# Altium schematic sheet GPSDO_Heater.SchDoc: Heater
size 420 x 297 mm; EDA_Number: ARTIQ; Projet: GPSDO; Author: K.Belewicz; CompanyName: WUT ISE; DrawnBy: K.Belewicz; Organization: WUT ISE; Address1: PW ISE; Address2: Nowowiejska 15/19 00-665 Warsaw; Address3: gkasprow@gmail.com; Revision: 1; SheetNumber: -; SheetTotal: -; ModifiedBy: -; CheckedDate: -; DivGrp: WUT ISE; Designer: G.Kasprowicz; ModifiedDate: -; ProjectName: Sensor Box
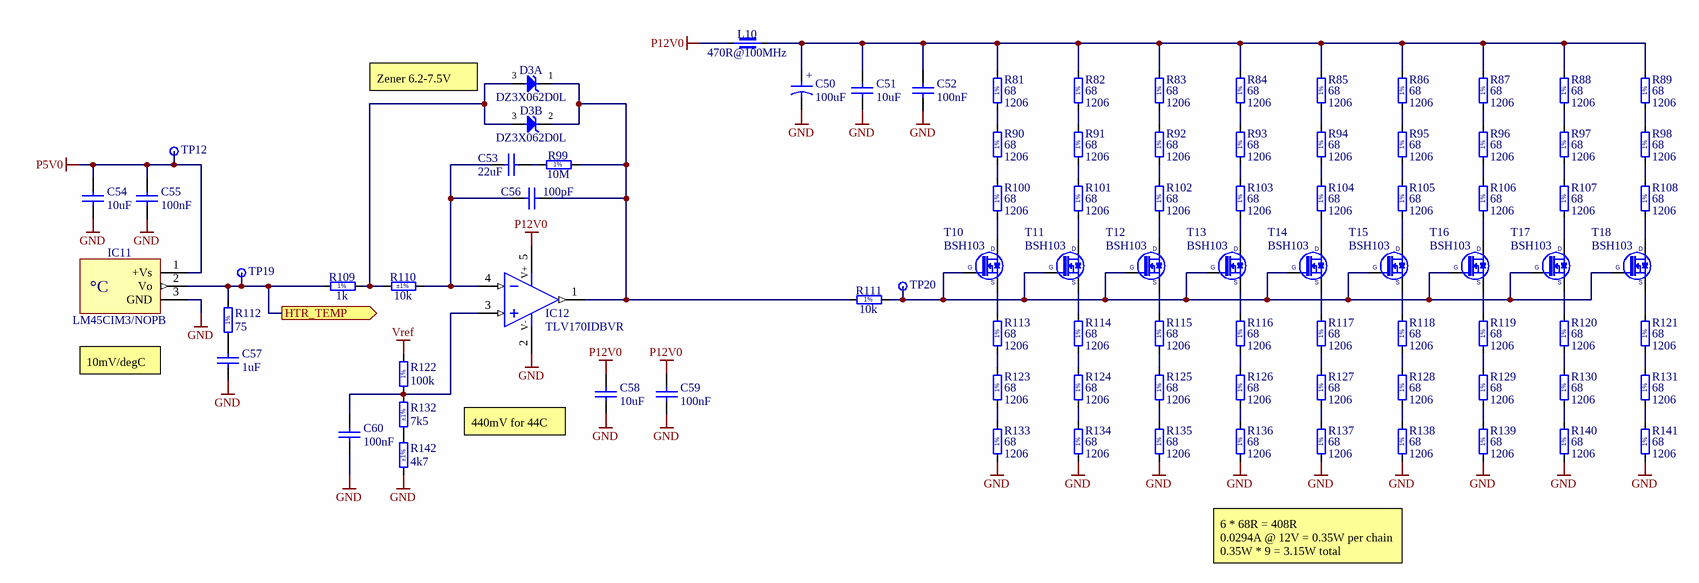
[diagram p0: GPSDO_Heater.SchDoc]

## Parts
C50  100uF  [CAPMP7343X310N]
C51  10uF  [CAPC1608X80N]
C52  100nF  [CAPC1005X55N]
C53  22uF  [CAPC2012X135N]
C54  10uF  [CAPC1608X80N]
C55  100nF  [CAPC1005X55N]
C56  100pF  [CAPC1005X55N]
C57  1uF  [CAPC1005X55N]
C58  10uF  [CAPC1608X80N]
C59  100nF  [CAPC1005X55N]
C60  100nF  [CAPC1005X55N]
D3  DZ3X062D0L  [SOT95P275X140-3N]  (parts A,B of 2)
IC11  LM45CIM3/NOPB  [SOT95P251X112-3N]
IC12  TLV170IDBVR  [SOT95P280X145-5N]
L10  470R@100MHz  [INDC1608X95N]
R81  68  Case: 1206  [RESC3216X65N]
R82  68  Case: 1206  [RESC3216X65N]
R83  68  Case: 1206  [RESC3216X65N]
R84  68  Case: 1206  [RESC3216X65N]
R85  68  Case: 1206  [RESC3216X65N]
R86  68  Case: 1206  [RESC3216X65N]
R87  68  Case: 1206  [RESC3216X65N]
R88  68  Case: 1206  [RESC3216X65N]
R89  68  Case: 1206  [RESC3216X65N]
R90  68  Case: 1206  [RESC3216X65N]
R91  68  Case: 1206  [RESC3216X65N]
R92  68  Case: 1206  [RESC3216X65N]
R93  68  Case: 1206  [RESC3216X65N]
R94  68  Case: 1206  [RESC3216X65N]
R95  68  Case: 1206  [RESC3216X65N]
R96  68  Case: 1206  [RESC3216X65N]
R97  68  Case: 1206  [RESC3216X65N]
R98  68  Case: 1206  [RESC3216X65N]
R99  10M  [RESC2113X55N]
R100  68  Case: 1206  [RESC3216X65N]
R101  68  Case: 1206  [RESC3216X65N]
R102  68  Case: 1206  [RESC3216X65N]
R103  68  Case: 1206  [RESC3216X65N]
R104  68  Case: 1206  [RESC3216X65N]
R105  68  Case: 1206  [RESC3216X65N]
R106  68  Case: 1206  [RESC3216X65N]
R107  68  Case: 1206  [RESC3216X65N]
R108  68  Case: 1206  [RESC3216X65N]
R109  1k  [RESC1005X40N]
R110  10k  Tolerance: ±1%  [RESC1005X40N]
R111  10k  [RESC1005X40N]
R112  75  [RESC1005X40N]
R113  68  Case: 1206  [RESC3216X65N]
R114  68  Case: 1206  [RESC3216X65N]
R115  68  Case: 1206  [RESC3216X65N]
R116  68  Case: 1206  [RESC3216X65N]
R117  68  Case: 1206  [RESC3216X65N]
R118  68  Case: 1206  [RESC3216X65N]
R119  68  Case: 1206  [RESC3216X65N]
R120  68  Case: 1206  [RESC3216X65N]
R121  68  Case: 1206  [RESC3216X65N]
R122  100k  [RESC1005X40N]
R123  68  Case: 1206  [RESC3216X65N]
R124  68  Case: 1206  [RESC3216X65N]
R125  68  Case: 1206  [RESC3216X65N]
R126  68  Case: 1206  [RESC3216X65N]
R127  68  Case: 1206  [RESC3216X65N]
R128  68  Case: 1206  [RESC3216X65N]
R129  68  Case: 1206  [RESC3216X65N]
R130  68  Case: 1206  [RESC3216X65N]
R131  68  Case: 1206  [RESC3216X65N]
R132  7k5  Tolerance: ±1%  [RESC1005X40N]
R133  68  Case: 1206  [RESC3216X65N]
R134  68  Case: 1206  [RESC3216X65N]
R135  68  Case: 1206  [RESC3216X65N]
R136  68  Case: 1206  [RESC3216X65N]
R137  68  Case: 1206  [RESC3216X65N]
R138  68  Case: 1206  [RESC3216X65N]
R139  68  Case: 1206  [RESC3216X65N]
R140  68  Case: 1206  [RESC3216X65N]
R141  68  Case: 1206  [RESC3216X65N]
R142  4k7  Tolerance: ±1%  [RESC1005X40N]
T10  BSH103  [SOT95P230X110-3N]
T11  BSH103  [SOT95P230X110-3N]
T12  BSH103  [SOT95P230X110-3N]
T13  BSH103  [SOT95P230X110-3N]
T14  BSH103  [SOT95P230X110-3N]
T15  BSH103  [SOT95P230X110-3N]
T16  BSH103  [SOT95P230X110-3N]
T17  BSH103  [SOT95P230X110-3N]
T18  BSH103  [SOT95P230X110-3N]
TP12  Test Point  [TPS127]  (value not drawn)  (no BOM)
TP19  Test Point  [TPS127]  (value not drawn)  (no BOM)
TP20  Test Point  [TPS127]  (value not drawn)  (no BOM)

## Ports
HTR_TEMP (out)

## Nets
GND: C50.2 C51.1 C52.1 C54.1 C55.1 C57.1 C58.1 C59.1 C60.1 IC11.3(GND) IC12.2(V-) R133.1 R134.1 R135.1 R136.1 R137.1 R138.1 R139.1 R140.1 R141.1 R142.1
P5V0: C54.2 C55.2 IC11.1(+Vs) TP12.1
P12V0: C58.2 C59.2 IC12.5(V+) L10.1
Vref: R122.2
HTR_TEMP: IC11.2(Vo) R109.1 R112.2 TP19.1 ; port HTR_TEMP
NetC50_1: C50.1 C51.2 C52.2 L10.2 R81.2 R82.2 R83.2 R84.2 R85.2 R86.2 R87.2 R88.2 R89.2
NetC53_1: C53.1 C56.1 IC12.4(IN-) R110.2
NetC53_2: C53.2 R99.1
NetC56_2: C56.2 D3.1(C) D3.2(C) IC12.1(OUT) R99.2 R111.1
NetC57_2: C57.2 R112.1
NetC60_2: C60.2 IC12.3(IN+) R122.1 R132.2
NetD3_3: D3.3(COMA) R109.2 R110.1
NetR81_1: R81.1 R90.2
NetR82_1: R82.1 R91.2
NetR83_1: R83.1 R92.2
NetR84_1: R84.1 R93.2
NetR85_1: R85.1 R94.2
NetR86_1: R86.1 R95.2
NetR87_1: R87.1 R96.2
NetR88_1: R88.1 R97.2
NetR89_1: R89.1 R98.2
NetR90_1: R90.1 R100.2
NetR91_1: R91.1 R101.2
NetR92_1: R92.1 R102.2
NetR93_1: R93.1 R103.2
NetR94_1: R94.1 R104.2
NetR95_1: R95.1 R105.2
NetR96_1: R96.1 R106.2
NetR97_1: R97.1 R107.2
NetR98_1: R98.1 R108.2
NetR100_1: R100.1 T10.3(D)
NetR101_1: R101.1 T11.3(D)
NetR102_1: R102.1 T12.3(D)
NetR103_1: R103.1 T13.3(D)
NetR104_1: R104.1 T14.3(D)
NetR105_1: R105.1 T15.3(D)
NetR106_1: R106.1 T16.3(D)
NetR107_1: R107.1 T17.3(D)
NetR108_1: R108.1 T18.3(D)
NetR111_2: R111.2 T10.1(G) T11.1(G) T12.1(G) T13.1(G) T14.1(G) T15.1(G) T16.1(G) T17.1(G) T18.1(G) TP20.1
NetR113_1: R113.1 R123.2
NetR113_2: R113.2 T10.2(S)
NetR114_1: R114.1 R124.2
NetR114_2: R114.2 T11.2(S)
NetR115_1: R115.1 R125.2
NetR115_2: R115.2 T12.2(S)
NetR116_1: R116.1 R126.2
NetR116_2: R116.2 T13.2(S)
NetR117_1: R117.1 R127.2
NetR117_2: R117.2 T14.2(S)
NetR118_1: R118.1 R128.2
NetR118_2: R118.2 T15.2(S)
NetR119_1: R119.1 R129.2
NetR119_2: R119.2 T16.2(S)
NetR120_1: R120.1 R130.2
NetR120_2: R120.2 T17.2(S)
NetR121_1: R121.1 R131.2
NetR121_2: R121.2 T18.2(S)
NetR123_1: R123.1 R133.2
NetR124_1: R124.1 R134.2
NetR125_1: R125.1 R135.2
NetR126_1: R126.1 R136.2
NetR127_1: R127.1 R137.2
NetR128_1: R128.1 R138.2
NetR129_1: R129.1 R139.2
NetR130_1: R130.1 R140.2
NetR131_1: R131.1 R141.2
NetR132_1: R132.1 R142.2

## Notes on the sheet
- (near D3) Zener 6.2-7.5V
- 10mV/degC
- 440mV for 44C
- 6 * 68R = 408R
  0.0294A @ 12V = 0.35W per chain
  0.35W * 9 = 3.15W total
- Project/Equipment
- Document
- Designer
- Drawn by
- Check.by
- Copyright WUT ISE 2020.
  This documentation describes Open Hardware and is licensed under the CERN OHL v.1.2. You may redistribute and modify this documentation under the terms of the CERN OHL v.1.2. (http://ohwr.org/CERNOHL). This documentation is distributed WITHOUT ANY EXPRESS OR IMPLIED WARRANTY, INCLUDING OF MERCHANTABILITY, SATISFACTORY QUALITY AND FITNESS FOR A PARTICULAR PURPOSE. Please see the CERN OHL v.1.2 for applicable conditions.
- Contact
- File
- Last Mod.
- Print Date
- Sheet
- Size
- A3
- of
- Rev
- (in symbol CTE7343-31_100UF_20V_10%) +
- (in symbol LM45CIM3/NOPB) °C
- (in symbol R0402_1k_1%_0.0625W_100PPM) 1%
- (in symbol R0402_10K_1%_0.0625W_100PPM) 1%
- (in symbol R0402_75R_1%_0.0625W_100PPM) 1%
- (in symbol R0402_100K_1%_0.0625W_100PPM) 1%
- (in symbol R0805_10M_1%_0.125W_100PPM_VISHAY_CRCW e3) 1%
- (in symbol R1206_68R_1%_0.25W_100PPM) 1%

## Library data of the parts
C50 = CTE7343-31_100UF_20V_10%: Polarised capacitor; Part Description: Solid Tantalum Chip Capacitor; Manufacturer: GENERIC; Manufacturer1 Part Number: TAJD107K020R; Voltage: 20V; Tolerance: ±10%; Part Number: CTE7343-31_100UF_20V_10%; Component Kind: Standard; Component Type: Standard; Pin Count: 2; Value: 100uF; Status: Preferred; Manufacturer Part Number: CTE7343-31_100UF_20V_10%; Case: D; Mounted: Yes; Socket: No; SMD: Yes; Sense: No; Manufacturer1 Example: AVX; Manufacturer1 ComponentHeight: 3.1mm; HelpURL: \\cern.ch\dfs\Applications\Altium\Datasheets\CTE_AVX_TAJ.pdf; Author: CERN DEM JLC; CreateDate: 03/12/2007; LatestRevisionDate: 03/12/2007
C51 C54 C58 = CC0603_10UF_10V_10%_X5R: Non-polarised capacitor; Part Description: SMD Multilayer Chip Ceramic Capacitor; Manufacturer: GENERIC; Manufacturer1 Part Number: GRM188R61A106KE69D; Voltage: 10V; TC: X5R; Tolerance: ±10%; Part Number: CC0603_10UF_10V_10%_X5R; Component Kind: Standard; Component Type: Standard; Pin Count: 2; Value: 10uF; Status: None; Manufacturer Part Number: CC0603_10UF_10V_10%_X5R; Case: 0603; Mounted: Yes; Socket: No; SMD: Yes; Sense: No; Manufacturer1 Example: MURATA; Manufacturer1 ComponentHeight: 0.8mm; HelpURL: \\cern.ch\dfs\Applications\Altium\Datasheets\CC0603_MURATA_GRM188R61A106KE69D.pdf; Author: CERN DEM JLC; CreateDate: 31.01.2017; LatestRevisionDate: 31.01.2017
C52 C55 C59 C60 = CC0402_100NF_16V_10%_X5R: Non-polarised capacitor; Part Description: SMD Multilayer Chip Ceramic Capacitor; Manufacturer: GENERIC; Manufacturer1 Part Number: GRM155R61C104KA88D; Voltage: 16V; TC: X5R; Tolerance: ±10%; Part Number: CC0402_100NF_16V_10%_X5R; Component Kind: Standard; Component Type: Standard; Pin Count: 2; Value: 100nF; Status: None; Manufacturer Part Number: CC0402_100NF_16V_10%_X5R; Case: 0402; Mounted: Yes; Socket: No; SMD: Yes; Sense: No; Manufacturer1 Example: MURATA; Manufacturer1 ComponentHeight: 0.55mm; HelpURL: \\cern.ch\dfs\Applications\Altium\Datasheets\CC0402_X5R_MURATA_GRM.pdf; Author: CERN DEM JLC; CreateDate: 10.12.2013; LatestRevisionDate: 10.12.2013
C53 = CC0805_22UF_16V_10%_X5R: Non-polarised capacitor; Manufacturer: GENERIC; Part Description: SMD Multilayer Chip Ceramic Capacitor; Manufacturer1 Part Number: C2012X5R1C226KT; Tolerance: ±10%; Voltage: 16V; TC: X5R; Manufacturer Part Number: CC0805_22UF_16V_10%_X5R; Part Number: CC0805_22UF_16V_10%_X5R; Value: 22uF; Component Kind: Standard; Component Type: Standard; Pin Count: 2; Status: Preferred; Case: 0805; Mounted: Yes; Socket: No; SMD: Yes; Sense: No; Manufacturer1 Example: TDK; Manufacturer1 ComponentHeight: 1.35mm; HelpURL: \\cern.ch\dfs\Applications\Altium\Datasheets\CC0805_X5R_TDK_C.pdf; Author: CERN DEM JLC; CreateDate: 25.10.2012; LatestRevisionDate: 25.10.2012
C56 = CC0402_100PF_50V_5%_C0G: Non-polarised capacitor; Part Description: SMD Multilayer Chip Ceramic Capacitor; Manufacturer: GENERIC; Manufacturer1 Part Number: C0402C101J5GACTU; Voltage: 50V; TC: C0G/NP0; Tolerance: ±5%; Part Number: CC0402_100PF_50V_5%_C0G; Component Kind: Standard; Component Type: Standard; Pin Count: 2; Value: 100pF; Status: Preferred; Manufacturer Part Number: CC0402_100PF_50V_5%_C0G; Case: 0402; Mounted: Yes; Socket: No; SMD: Yes; Sense: No; Manufacturer1 Example: KEMET; Manufacturer1 ComponentHeight: 0.55mm; HelpURL: \\cern.ch\dfs\Applications\Altium\Datasheets\CC0402_C0G_KEMET_(Commercial Grade).pdf; Author: CERN DEM JLC; CreateDate: 03/12/2007; LatestRevisionDate: 22/04/2015
C57 = CC0402_1UF_16V_10%_X5R: Non-polarised capacitor; Part Description: SMD Multilayer Chip Ceramic Capacitor; Manufacturer: GENERIC; Manufacturer1 Part Number: C1005X5R1C105KT; Voltage: 16V; TC: X5R; Tolerance: ±10%; Part Number: CC0402_1UF_16V_10%_X5R; Component Kind: Standard; Component Type: Standard; Pin Count: 2; Value: 1uF; Status: Preferred; Manufacturer Part Number: CC0402_1UF_16V_10%_X5R; Case: 0402; Mounted: Yes; Socket: No; SMD: Yes; Sense: No; Manufacturer1 Example: TDK; Manufacturer1 ComponentHeight: 0.55mm; HelpURL: \\cern.ch\dfs\Applications\Altium\Datasheets\CC0402_X5R_TDK_C.pdf; Author: CERN DEM JLC; CreateDate: 25.10.2012; LatestRevisionDate: 25.10.2012
D3 = DZ3X062D0L: Dual Common Anode Zener Diode; Part Description: Dual Common Anode Silicon Epitaxial Planar Diode; Manufacturer: PANASONIC; Voltage: 6.2V; Power: 200mA; PressFit: No; Bonding: No; Part Number: DZ3X062D0L; Component Kind: Standard; Component Type: Standard; Device: DZ3X062D0L; PackageDescription: SOT, 0.95mm Pitch; 3 Pin, 1.60mm W X 2.975mm L X 1.40mm H Body, IPC Medium Density; Manufacturer Part Number: DZ3X062D0L; Pin Count: 3; Case: SOT23-3; Mounted: Yes; Socket: No; SMD: Yes; Sense: No; ComponentHeight: 1.40mm; HelpURL: \\cern.ch\dfs\Applications\Altium\Datasheets\DZ3X062D0L.pdf; Author: CERN DEM JLC; CreateDate: 30/09/2014; LatestRevisionDate: 30/09/2014
IC11 = LM45CIM3/NOPB: -20° to +100°C ±3°C Precision Centigrade Temperature Sensors; Manufacturer: TEXAS INSTRUMENTS; PressFit: No; Bonding: No; Part Number: LM45CIM3/NOPB; Component Kind: Standard; Component Type: Standard; Device: LM45CIM3/NOPB; PackageDescription: SOT, 0.95mm Pitch; 3 Pin, 1.30mm W X 2.92mm L X 1.12mm H body, IPC Medium Density; Part Description: -20° to +100°C ±3°C Precision Centigrade Temperature Sensors; Manufacturer Part Number: LM45CIM3/NOPB; Pin Count: 3; Case: SOT23; Mounted: Yes; Socket: No; SMD: Yes; Sense: No; ComponentHeight: 1.12mm; HelpURL: \\cern.ch\dfs\Applications\Altium\Datasheets\LM45CIM3-NOPB.pdf; Author: CERN DEM JLC; CreateDate: 19/01/2011; LatestRevisionDate: 19/01/2011
IC12 = TLV170IDBVR: Low-Power, 36-V Operational Amplifier; Manufacturer: TEXAS INSTRUMENTS; Part Number: TLV170IDBVR; Device: TLV170IDBVR; Component Kind: Standard; Component Type: Standard; PackageDescription: SOT, 0.95mm pitch; 5 pin, 1.60mm W X 2.90mm L X 1.45mm H body, IPC Medium Density; Part Description: Low-Power, 36-V Operational Amplifier; Case: SOT 23-5; Manufacturer Part Number: TLV170IDBVR
L10 = IND0603_MURATA_BLM18PG471SN1D: Part Description: SMD EMIFIL Chip Ferrite Bead; Manufacturer: MURATA; Power: 1A; Resistance: 0.2R; Tolerance: ±25%; Part Number: IND0603_MURATA_BLM18PG471SN1D; Component Kind: Standard; Component Type: Standard; Pin Count: 2; Value: 470R@100MHz; Manufacturer Part Number: BLM18PG471SN1D; Case: 0603; Mounted: Yes; Socket: No; SMD: Yes; Sense: No; ComponentHeight: 0.95mm; HelpURL: \\cern.ch\dfs\Applications\Altium\Datasheets\IND0603_MURATA_BLM18P.pdf; Author: CERN DEM BC; CreateDate: 17.02.2021; LatestRevisionDate: 17.02.2021
R81-R98 R100-R108 R113-R121 R123-R131 R133-R141 = R1206_68R_1%_0.25W_100PPM: Resistor - 1%; Part Description: General Purpose Thick Film Chip Resistor; Manufacturer: GENERIC; Manufacturer1 Part Number: NRC12F68R0TRF; Power: 0.25W; TC: ±100ppm/°C; PressFit: No; Part Number: R1206_68R_1%_0.25W_100PPM; Component Kind: Standard; Component Type: Standard; Pin Count: 2; Value: 68; Status: Preferred; Tolerance: ±1%; Manufacturer Part Number: R1206_68R_1%_0.25W_100PPM; Mounted: Yes; Sense: No; Socket: No; SMD: Yes; Manufacturer1 Example: NIC COMPONENT; Manufacturer1 ComponentHeight: 0.65mm; HelpURL: \\cern.ch\dfs\Applications\Altium\Datasheets\R1206_NIC_NRC.pdf; Author: CERN DEM JLC; CreateDate: 03/12/2007; LatestRevisionDate: 13/03/2008
R99 = R0805_10M_1%_0.125W_100PPM_VISHAY_CRCW e3: Resistor - 1%; Part Description: 150V, Standard Thick Film Chip Resistor; Manufacturer: VISHAY DALE; Manufacturer Part Number: CRCW080510M0FKEA; Power: 0.125W; TC: ±100ppm/°C; PressFit: No; Part Number: R0805_10M_1%_0.125W_100PPM_VISHAY_CRCW e3; Component Kind: Standard; Component Type: Standard; Pin Count: 2; Value: 10M; Status: None; Tolerance: ±1%; Case: 0805; Mounted: Yes; Sense: No; Socket: No; SMD: Yes; ComponentHeight: 0.5mm; HelpURL: \\cern.ch\dfs\Applications\Altium\Datasheets\R0805_VISHAY_CRCW e3.pdf; Author: CERN DEM BC; CreateDate: 2019-11-12; LatestRevisionDate: 2019-11-12
R109 = R0402_1k_1%_0.0625W_100PPM: Resistor - 1%; Part Description: General Purpose Thick Film Chip Resistor; Manufacturer: GENERIC; Manufacturer1 Part Number: 232270671002L; TC: ±100ppm/°C; PressFit: No; Part Number: R0402_1K_1%_0.0625W_100PPM; Component Kind: Standard; Component Type: Standard; Pin Count: 2; Value: 1k; Status: Not Recommended; Power: 0.0625W; Tolerance: ±1%; Manufacturer Part Number: R0402_1K_1%_0.0625W_100PPM; Case: 0402; Mounted: Yes; Sense: No; Socket: No; SMD: Yes; Manufacturer1 Example: YAGEO PHYCOMP; Manufacturer1 ComponentHeight: 0.4mm; HelpURL: \\cern.ch\dfs\Applications\Altium\Datasheets\R0402_Phycomp_RC0402.pdf; Author: CERN DEM JLC; CreateDate: 03.12.2007; LatestRevisionDate: 17.10.2012; ClassName: Artix
R110 R111 = R0402_10K_1%_0.0625W_100PPM: Resistor - 1%; Part Description: General Purpose Thick Film Chip Resistor; Manufacturer: GENERIC; Manufacturer1 Part Number: 232270671003L; TC: ±100ppm/°C; PressFit: No; Part Number: R0402_10K_1%_0.0625W_100PPM; Component Kind: Standard; Component Type: Standard; Pin Count: 2; Value: 10k; Status: Not Recommended; Power: 0.0625W; Manufacturer Part Number: R0402_10K_1%_0.0625W_100PPM; Case: 0402; Mounted: Yes; Sense: No; Socket: No; SMD: Yes; Manufacturer1 Example: YAGEO PHYCOMP; Manufacturer1 ComponentHeight: 0.4mm; HelpURL: \\cern.ch\dfs\Applications\Altium\Datasheets\R0402_Phycomp_RC0402.pdf; Author: CERN DEM JLC; CreateDate: 03.12.2007; LatestRevisionDate: 17.10.2012
  R111: Tolerance: ±1%
R112 = R0402_75R_1%_0.0625W_100PPM: Resistor - 1%; Part Description: General Purpose Thick Film Chip Resistor; Manufacturer: GENERIC; Manufacturer1 Part Number: 232270677509L; TC: ±100ppm/°C; PressFit: No; Part Number: R0402_75R_1%_0.0625W_100PPM; Component Kind: Standard; Component Type: Standard; Pin Count: 2; Value: 75; Status: Not Recommended; Power: 0.0625W; Tolerance: ±1%; Manufacturer Part Number: R0402_75R_1%_0.0625W_100PPM; Case: 0402; Mounted: Yes; Sense: No; Socket: No; SMD: Yes; Manufacturer1 Example: YAGEO PHYCOMP; Manufacturer1 ComponentHeight: 0.4mm; HelpURL: \\cern.ch\dfs\Applications\Altium\Datasheets\R0402_Phycomp_RC0402.pdf; Author: CERN DEM JLC; CreateDate: 03/12/2007; LatestRevisionDate: 17/10/2012
R122 = R0402_100K_1%_0.0625W_100PPM: Resistor - 1%; Part Description: General Purpose Thick Film Chip Resistor; Manufacturer: GENERIC; Manufacturer1 Part Number: 232270671004L; TC: ±100ppm/°C; PressFit: No; Part Number: R0402_100K_1%_0.0625W_100PPM; Component Kind: Standard; Component Type: Standard; Pin Count: 2; Value: 100k; Status: Not Recommended; Power: 0.0625W; Tolerance: ±1%; Manufacturer Part Number: R0402_100K_1%_0.0625W_100PPM; Case: 0402; Mounted: Yes; Sense: No; Socket: No; SMD: Yes; Manufacturer1 Example: YAGEO PHYCOMP; Manufacturer1 ComponentHeight: 0.4mm; HelpURL: \\cern.ch\dfs\Applications\Altium\Datasheets\R0402_Phycomp_RC0402.pdf; Author: CERN DEM JLC; CreateDate: 03/12/2007; LatestRevisionDate: 17/10/2012
R132 = R0402_7K5_1%_0.0625W_100PPM: Resistor - 1%; Part Description: General Purpose Thick Film Chip Resistor; Manufacturer: GENERIC; Manufacturer1 Part Number: 232270677502L; TC: ±100ppm/°C; PressFit: No; Part Number: R0402_7K5_1%_0.0625W_100PPM; Component Kind: Standard; Component Type: Standard; Pin Count: 2; Value: 7k5; Status: Not Recommended; Power: 0.0625W; Manufacturer Part Number: R0402_7K5_1%_0.0625W_100PPM; Case: 0402; Mounted: Yes; Sense: No; Socket: No; SMD: Yes; Manufacturer1 Example: YAGEO PHYCOMP; Manufacturer1 ComponentHeight: 0.4mm; HelpURL: \\cern.ch\dfs\Applications\Altium\Datasheets\R0402_Phycomp_RC0402.pdf; Author: CERN DEM JLC; CreateDate: 03.12.2007; LatestRevisionDate: 17.10.2012
R142 = R0402_4K7_1%_0.0625W_100PPM: Resistor - 1%; Part Description: General Purpose Thick Film Chip Resistor; Manufacturer: GENERIC; Manufacturer1 Part Number: 232270674702L; TC: ±100ppm/°C; PressFit: No; Part Number: R0402_4K7_1%_0.0625W_100PPM; Component Kind: Standard; Component Type: Standard; Pin Count: 2; Value: 4k7; Status: Not Recommended; Power: 0.0625W; Manufacturer Part Number: R0402_4K7_1%_0.0625W_100PPM; Case: 0402; Mounted: Yes; Sense: No; Socket: No; SMD: Yes; Manufacturer1 Example: YAGEO PHYCOMP; Manufacturer1 ComponentHeight: 0.4mm; HelpURL: \\cern.ch\dfs\Applications\Altium\Datasheets\R0402_Phycomp_RC0402.pdf; Author: CERN DEM JLC; CreateDate: 03.12.2007; LatestRevisionDate: 17.10.2012
T10-T18 = BSH103: N-CHANNEL MOSFET WITH DIODE; Part Description: 30V 850mA N-Channel Enhancement Mode Field-Effect Transistor; Manufacturer: NEXPERIA; PressFit: No; Bonding: No; Part Number: BSH103; Component Kind: Standard; Component Type: Standard; Device: BSH103; PackageDescription: SOT23, 3 pin, Pitch 0.95mm - 1.3mm W X 2.9mm L X 1.1mm H, IPC Medium Density; Manufacturer Part Number: BSH103; Pin Count: 3; Case: SOT23-3; Mounted: Yes; Socket: No; SMD: Yes; Sense: No; ComponentHeight: 1.1mm; HelpURL: \\cern.ch\dfs\Applications\Altium\Datasheets\BSH103.pdf; Author: CERN DEM JLC; CreateDate: 16.03.2010; LatestRevisionDate: 20.06.2017
TP12 TP19 TP20 = SMD_PAD_1.27X1.27MM: Part Description: 1.27mm x 1.27mm PCB Copper Area (SMD Test Point); Mounted: No; Part Number: SMD_PAD_1.27X1.27MM; Component Type: Standard (No BOM); Pin Count: 1; Family: Test Point; Socket: No; SMD: Yes; Sense: No; Status: None; ComponentHeight: 0mm; HelpURL: Undefined; Author: CERN DEM JLC; CreateDate: 12.01.2008; LatestRevisionDate: 12.01.2008; PackageDescription: 1.27mm x 1.27mm PCB Copper Area (SMD Test Point)